# Altium schematic sheet Arduino Schematic.SchDoc
size A2; SheetNumber: 1; SheetTotal: 1
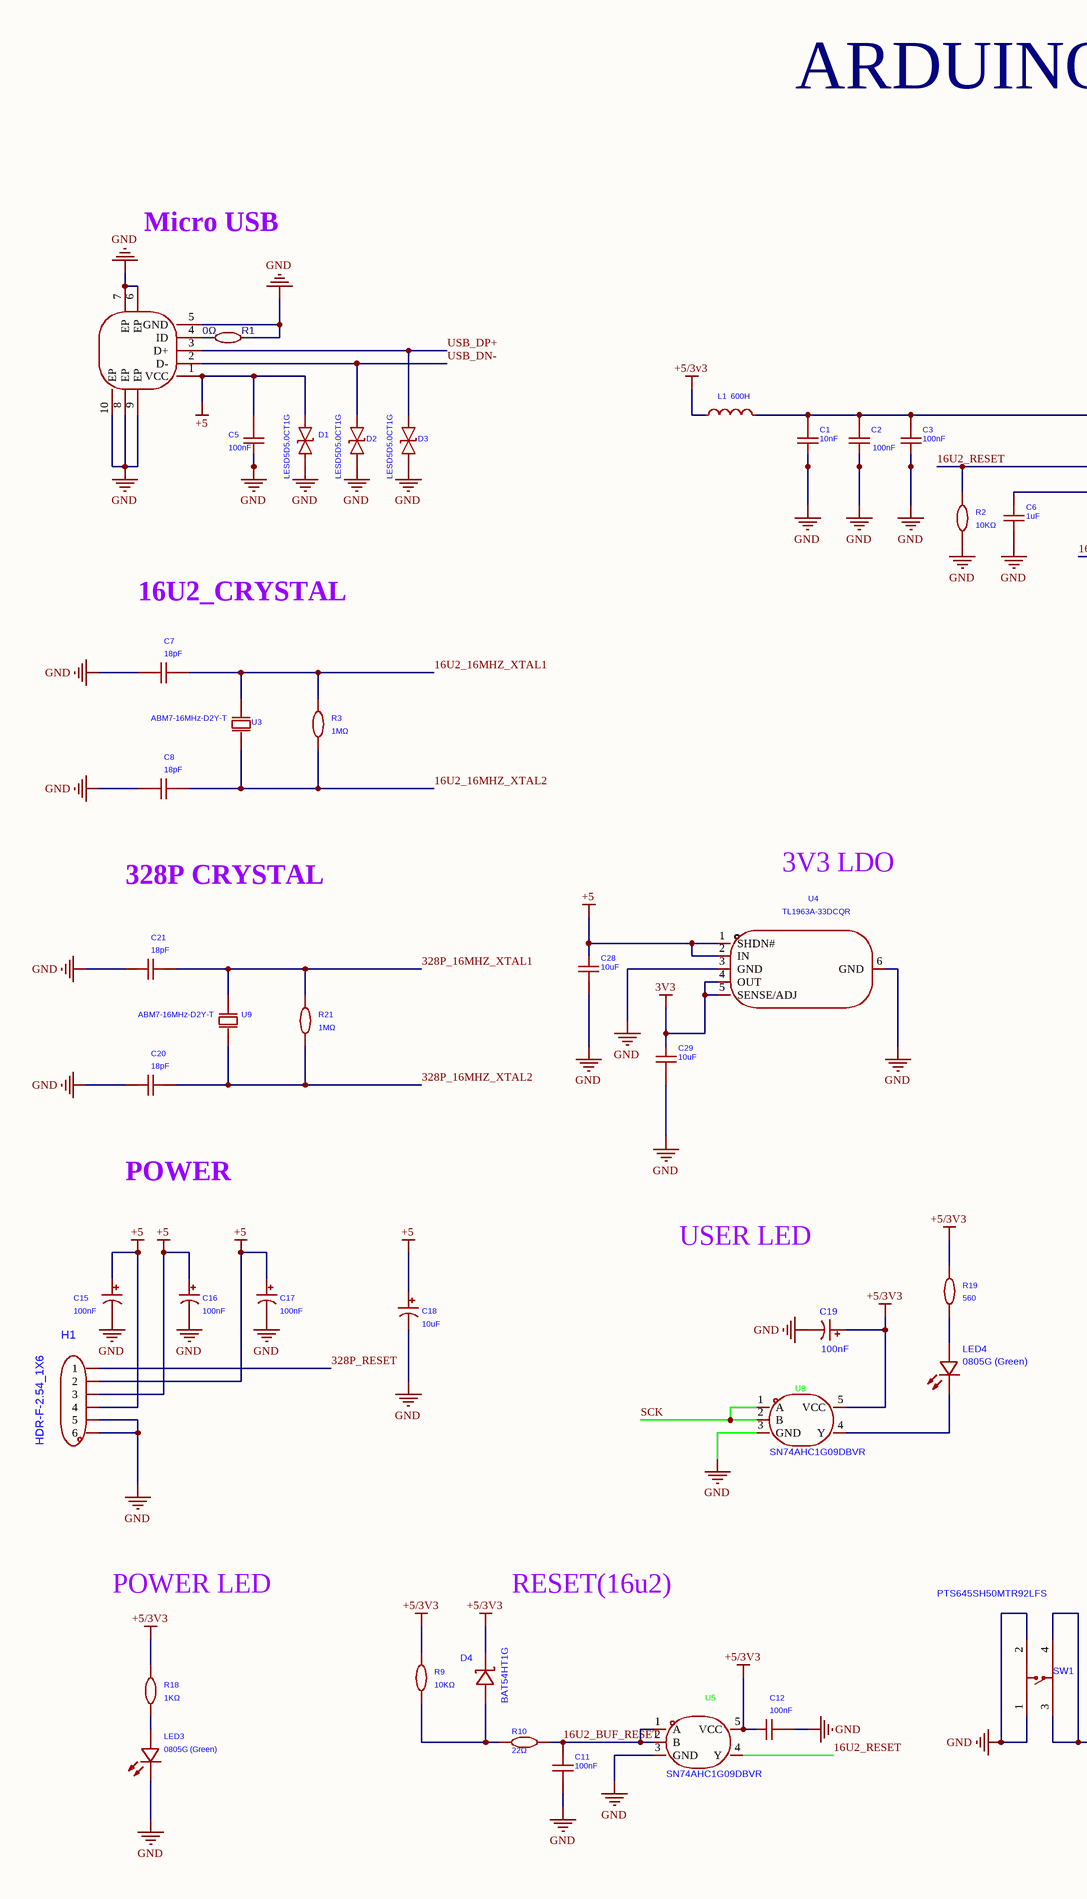
[diagram p0: Arduino Schematic.SchDoc, left]
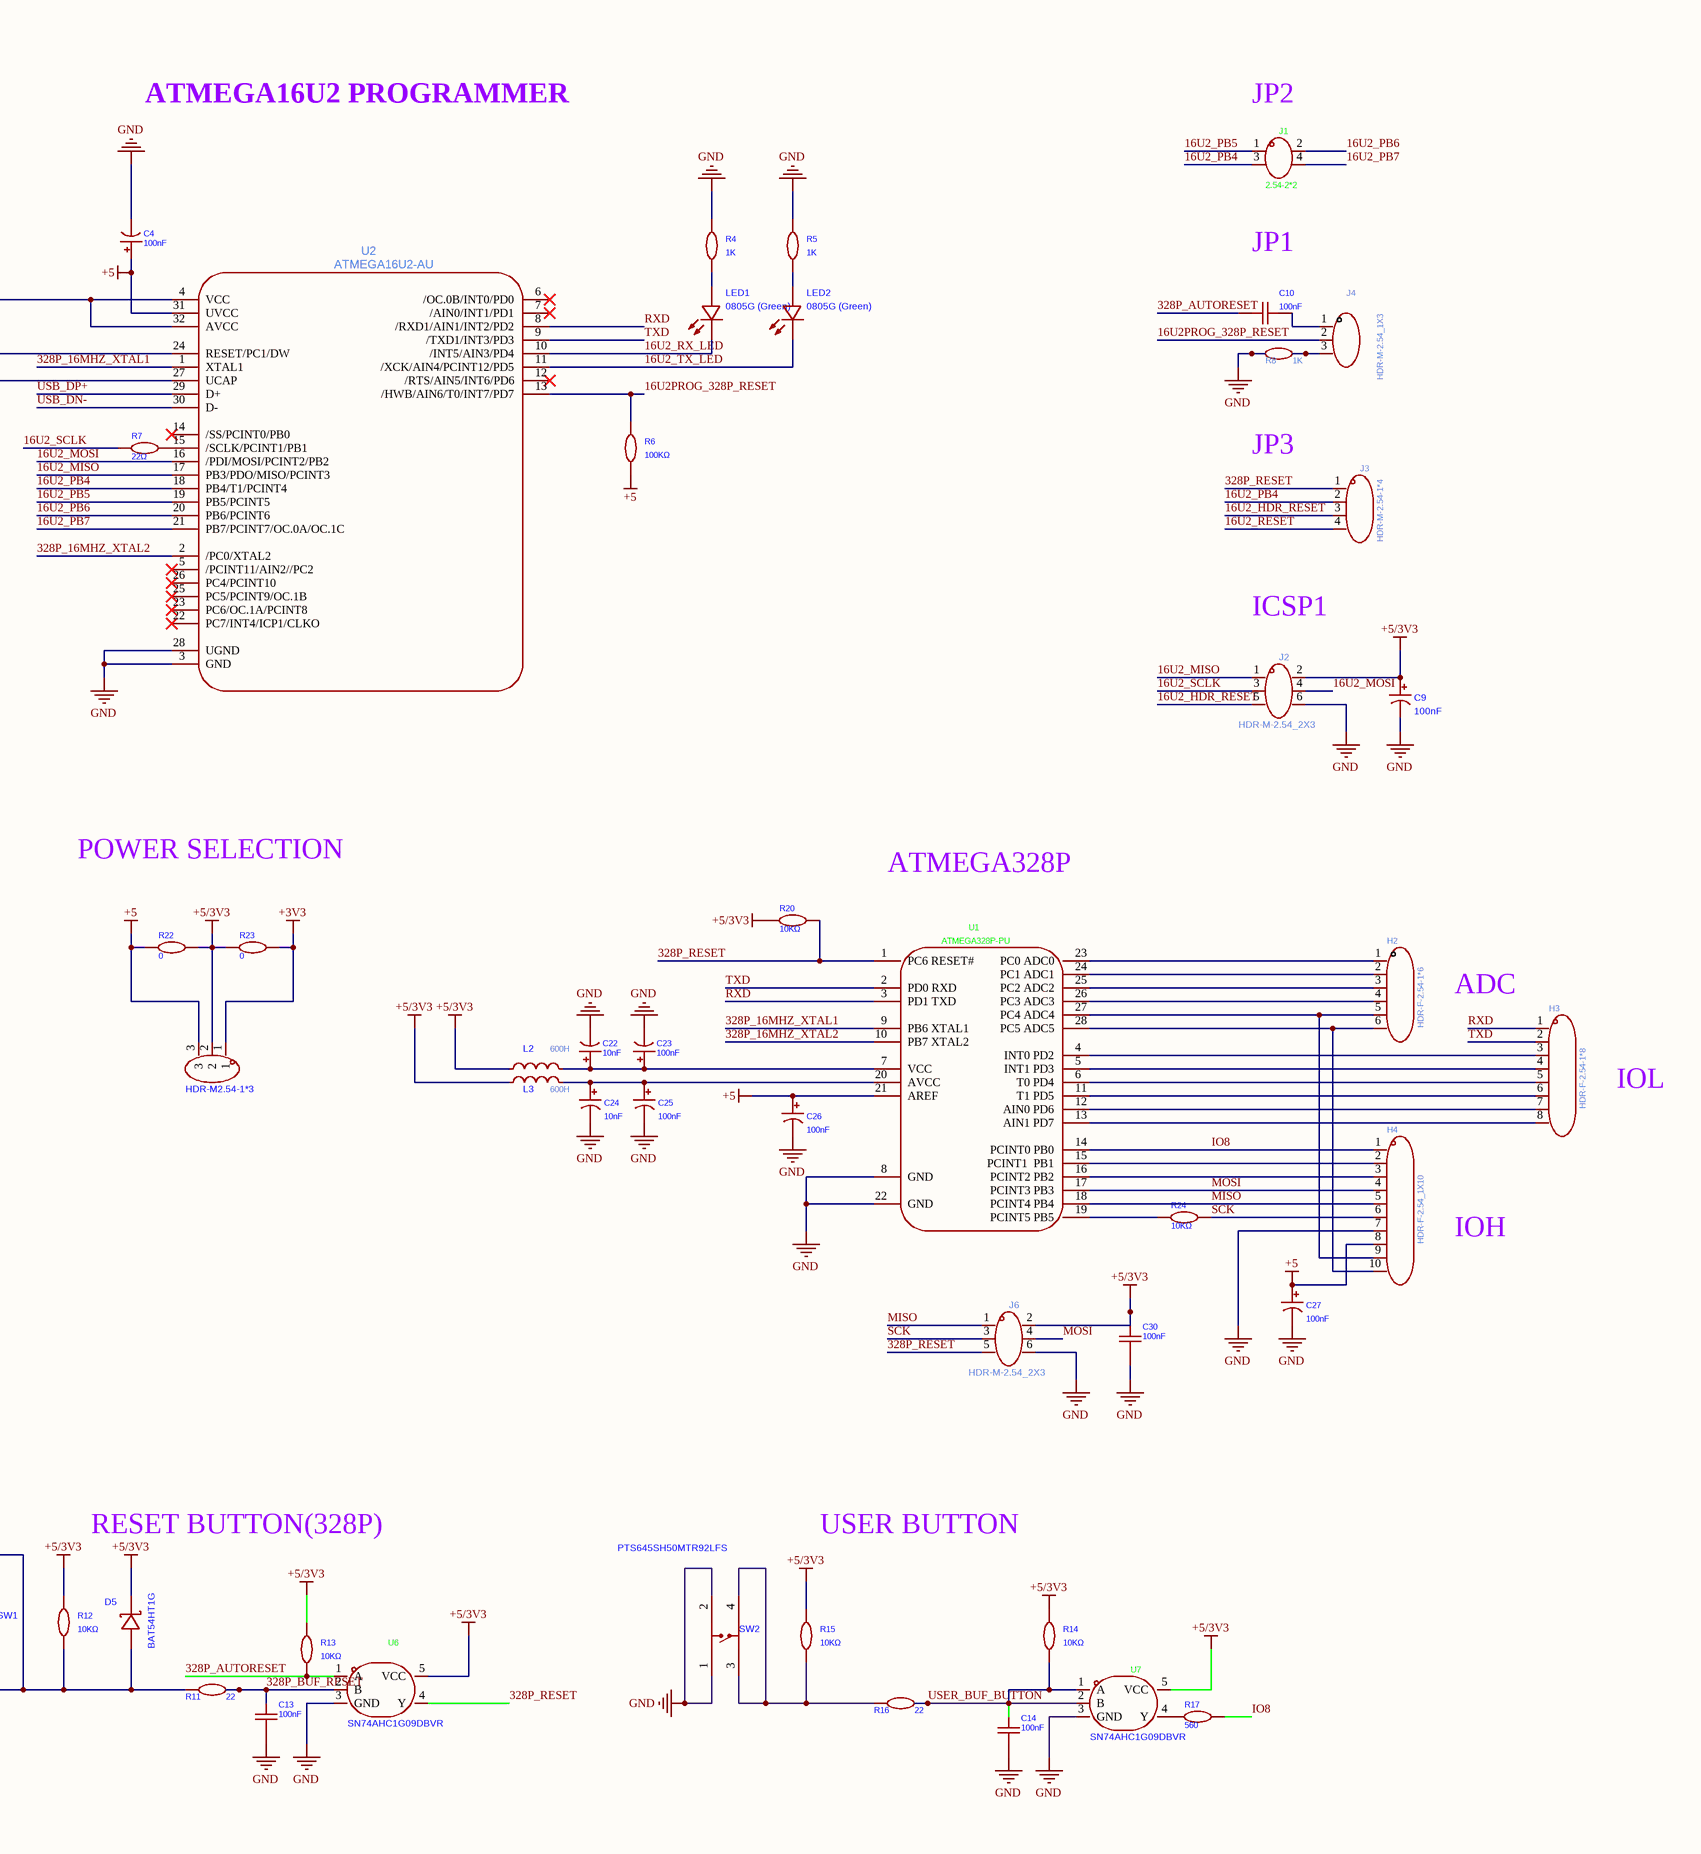
[diagram p1: Arduino Schematic.SchDoc, right]

## Parts
C1  10nF  [SOD-323_L1.8-W1.3-LS2.5-RD]
C2  100nF  [C0402]
C3  100nF  [C0402]
C4  100nF  [C0402]
C5  100nF  [C0402]
C6  1uF  [C0402]
C7  18pF  [C0402]
C8  18pF  [C0402]
C9  100nF  [C0402]
C10  100nF  [C0402]
C11  100nF  [C0402]
C12  100nF  [C0402]
C13  100nF  [C0402]
C14  100nF  [C0402]
C15  100nF  [C0402]
C16  100nF  [C0402]
C17  100nF  [C0402]
C18  10uF  [CAP-TH_BD5.0-P2.00-D0.8-FD]
C19  100nF  [C0402]
C20  18pF  [C0402]
C21  18pF  [C0402]
C22  10nF  [C0402]
C23  100nF  [C0402]
C24  10nF  [C0402]
C25  100nF  [C0402]
C26  100nF  [C0402]
C27  100nF  [C0402]
C28  10uF  [CAP-TH_BD5.0-P2.00-D0.8-FD]
C29  10uF  [C0402]
C30  100nF  [C0402]
D1  LESD5D5.0CT1G  [SOD-523_L1.2-W0.8-LS1.6-BI]
D2  LESD5D5.0CT1G  [SOD-523_L1.2-W0.8-LS1.6-BI]
D3  LESD5D5.0CT1G  [SOD-523_L1.2-W0.8-LS1.6-BI]
D4  BAT54HT1G  [SOD-323_L1.8-W1.3-LS2.5-RD]
D5  BAT54HT1G  [SOD-323_L1.8-W1.3-LS2.5-RD]
H1  HDR-F-2.54_1X6  [HDR-TH_6P-P2.54-V-M]
H2  HDR-F-2.54-1*6  [HDR-TH_6P-P2.54-V-M]
H3  HDR-F-2.54-1*8  [HDR-TH_8P-P2.54-V-F]
H4  HDR-F-2.54_1X10  [HDR-TH_10P-P2.54-V-F]
J1  2.54-2*2  [HDR-TH_4P-P2.54-V-F-R2-C2-S2.54]
J2  HDR-M-2.54_2X3  [HDR-TH_6P-P2.54-V-F-R2-C3-S2.54]
J3  HDR-M-2.54-1*4  [HDR-TH_4P-P2.54-V-F]
J4  HDR-M-2.54_1X3  [HDR-TH_3P-P2.54-V-F]
J5  HDR-M2.54-1*3  [HDR-TH_3P-P2.54-V-F]
J6  HDR-M-2.54_2X3  [HDR-TH_6P-P2.54-V-F-R2-C3-S2.54]
L1  600H  [L0402]
L2  600H  [L0402]
L3  600H  [L0402]
LED1  0805G (Green)  [LED0805-R-RD]
LED2  0805G (Green)  [LED0805-R-RD]
LED3  0805G (Green)  [LED0805-R-RD]
LED4  0805G (Green)  [LED0805-R-RD]
R1  0Ω  [R0603]
R2  10KΩ  [R0402]
R3  1MΩ  [R0402]
R4  1K  [R0402]
R5  1K  [R0402]
R6  100KΩ  [R0402]
R7  22Ω  [R0402]
R8  1K  [R0402]
R9  10KΩ  [R0402]
R10  22Ω  [R0402]
R11  22  [R0402]
R12  10KΩ  [R0402]
R13  10KΩ  [R0402]
R14  10KΩ  [R0402]
R15  10KΩ  [R0402]
R16  22  [R0402]
R17  560  [R0402]
R18  1KΩ  [R0402]
R19  560  [R0402]
R20  10KΩ  [R0402]
R21  1MΩ  [R0402]
R22  0  [R0402]
R23  0  [R0402]
R24  10KΩ  [R0402]
SW1  PTS645SH50MTR92LFS  [SW-TH_4P-L6.0-W6.0-P4.50-LS6.5]
SW2  PTS645SH50MTR92LFS  [SW-TH_4P-L6.0-W6.0-P4.50-LS6.5]
U1  ATMEGA328P-PU  [DIP-28_L34.6-W7.3-P2.54-LS10.2-BL]
U2  ATMEGA16U2-AU  [TQFP-32_L7.0-W7.0-P0.80-LS9.0-TL]
U3  ABM7-16MHz-D2Y-T  [OSC-SMD_L5.0-W3.2]
U4  TL1963A-33DCQR  [SOT-223-6_L6.5-W3.5-P1.27-LS7.0-BR]
U5  SN74AHC1G09DBVR  [SOT-23-5_L2.9-W1.6-P0.95-LS2.8-BL]
U6  SN74AHC1G09DBVR  [SOT-23-5_L2.9-W1.6-P0.95-LS2.8-BL]
U7  SN74AHC1G09DBVR  [SOT-23-5_L2.9-W1.6-P0.95-LS2.8-BL]
U8  SN74AHC1G09DBVR  [SOT-23-5_L2.9-W1.6-P0.95-LS2.8-BL]
U9  ABM7-16MHz-D2Y-T  [OSC-SMD_L5.0-W3.2]
USB1  1050170001  [MICRO-USB-SMD_105017-0001]  (value not drawn)

## Nets
3V3: C29.2 U4.4(OUT) U4.5(SENSE/ADJ)
+3V3: J5.1 R23.1
+5: C4.1 C5.2 C15.1 C16.1 C17.1 C18.1 C26.1 C27.1 C28.2 D1.2 H1.3(4) H1.4(3) H1.5(2) H4.8 J5.3 R6.1 R22.2 U1.21(AREF) U2.31(UVCC) U4.1(SHDN#) U4.2(IN) USB1.1(VCC)
+5/3V3: C9.1 C12.2 C19.1 C30.2 D4.1(K) D5.1(K) J2.2 J5.2 J6.2 L1.1 L2.1 L3.1 R9.2 R12.2 R13.2 R14.2 R15.2 R18.2 R19.2 R20.2 R22.1 R23.2 U5.5(VCC) U6.5(VCC) U7.5(VCC) U8.5(VCC)
GND: C1.1 C2.1 C3.1 C4.2 C5.1 C6.1 C7.1 C8.1 C9.2 C11.1 C12.1 C13.1 C14.1 C15.2 C16.2 C17.2 C18.2 C19.2 C20.1 C21.1 C22.2 C23.2 C24.2 C25.2 C26.2 C27.2 C28.1 C29.1 C30.1 D1.1 D2.1 D3.1 H1.1(6) H1.2(5) H4.7 J2.6 J6.6 LED3.2(K) R1.2 R2.1 R4.2 R5.2 R8.2 SW1.1 SW1.2 SW2.1 SW2.2 U1.8(GND) U1.22(GND) U2.3(GND) U2.28(UGND) U4.3(GND) U4.6(GND) U5.3(GND) U6.3(GND) U7.3(GND) U8.3(GND) USB1.5(GND) USB1.6(EP) USB1.7(EP) USB1.8(EP) USB1.9(EP) USB1.10(EP)
16U2_16MHZ_XTAL1: C7.2 R3.2 U3.2(OSC2)
16U2_16MHZ_XTAL2: C8.2 R3.1 U3.1(OSC1)
16U2_BUF_RESET: C11.2 R10.1 U5.1(A) U5.2(B)
16U2_HDR_RESET: J2.5 J3.3
16U2_MISO: J2.1 U2.17(PB3/PDO/MISO/PCINT3)
16U2_MOSI: J2.4 U2.16(/PDI/MOSI/PCINT2/PB2)
16U2_PB4: J1.3 J3.2 U2.18(PB4/T1/PCINT4)
16U2_PB5: J1.1 U2.19(PB5/PCINT5)
16U2_PB6: J1.2 U2.20(PB6/PCINT6)
16U2_PB7: J1.4 U2.21(PB7/PCINT7/OC.0A/OC.1C)
16U2_RESET: J3.4 R2.2 U2.24(RESET/PC1/DW) U5.4(Y)
16U2_RX_LED: LED1.2(K) U2.10(/INT5/AIN3/PD4)
16U2_SCLK: J2.3 R7.2
16U2_TX_LED: LED2.2(K) U2.11(/XCK/AIN4/PCINT12/PD5)
16U2PROG_328P_RESET: J4.2 R6.2 U2.13(/HWB/AIN6/T0/INT7/PD7)
328P_16MHZ_XTAL1: C21.2 R21.2 U1.9(PB6_XTAL1) U2.1(XTAL1) U9.2(OSC2)
328P_16MHZ_XTAL2: C20.2 R21.1 U1.10(PB7_XTAL2) U2.2(/PC0/XTAL2) U9.1(OSC1)
328P_AUTORESET: C10.2 R13.1 U6.1(A)
328P_BUF_RESET: C13.2 R11.1 U6.2(B)
328P_RESET: H1.6(1) J3.1 J6.5 R20.1 U1.1(PC6_RESET#) U6.4(Y)
IO8: H4.1 R17.1 U1.14(PCINT0_PB0)
MISO: H4.5 J6.1 U1.18(PCINT4_PB4)
MOSI: H4.4 J6.4 U1.17(PCINT3_PB3)
RXD: H3.1 U1.3(PD1_TXD) U2.8(/RXD1/AIN1/INT2/PD2)
SCK: H4.6 J6.3 R24.1 U8.1(A) U8.2(B)
TXD: H3.2 U1.2(PD0_RXD) U2.9(/TXD1/INT3/PD3)
USB_DN-: D2.2 U2.30(D-) USB1.2(D-)
USB_DP+: D3.2 U2.29(D+) USB1.3(D+)
USER_BUF_BUTTON: C14.2 R14.1 R16.1 U7.1(A) U7.2(B)
NetC1_2: C1.2 C2.2 C3.2 L1.2 U2.4(VCC) U2.32(AVCC)
NetC6_2: C6.2 U2.27(UCAP)
NetC10_1: C10.1 J4.1
NetC22_1: C22.1 C23.1 L2.2 U1.7(VCC)
NetC24_1: C24.1 C25.1 L3.2 U1.20(AVCC)
NetD4_2: D4.2(A) R9.1 R10.2
NetD5_2: D5.2(A) R11.2 R12.1 SW1.3 SW1.4
NetH2_1: H2.1 U1.23(PC0_ADC0)
NetH2_2: H2.2 U1.24(PC1_ADC1)
NetH2_3: H2.3 U1.25(PC2_ADC2)
NetH2_4: H2.4 U1.26(PC3_ADC3)
NetH2_5: H2.5 H4.9 U1.27(PC4_ADC4)
NetH2_6: H2.6 H4.10 U1.28(PC5_ADC5)
NetH3_3: H3.3 U1.4(INT0_PD2)
NetH3_4: H3.4 U1.5(INT1_PD3)
NetH3_5: H3.5 U1.6(T0_PD4)
NetH3_6: H3.6 U1.11(T1_PD5)
NetH3_7: H3.7 U1.12(AIN0_PD6)
NetH3_8: H3.8 U1.13(AIN1_PD7)
NetH4_2: H4.2 U1.15(PCINT1__PB1)
NetH4_3: H4.3 U1.16(PCINT2_PB2)
NetJ4_3: J4.3 R8.1
NetLED1_1: LED1.1(A) R4.1
NetLED2_1: LED2.1(A) R5.1
NetLED3_1: LED3.1(A) R18.1
NetLED4_1: LED4.1(A) R19.1
NetLED4_2: LED4.2(K) U8.4(Y)
NetR1_1: R1.1 USB1.4(ID)
NetR7_1: R7.1 U2.15(/SCLK/PCINT1/PB1)
NetR15_1: R15.1 R16.2 SW2.3 SW2.4
NetR17_2: R17.2 U7.4(Y)
NetR24_2: R24.2 U1.19(PCINT5_PB5)

Not connected (* = marked no-connect by the designer): U2 5(/PCINT11/AIN2//PC2)* 6(/OC.0B/INT0/PD0)* 7(/AIN0/INT1/PD1)* 12(/RTS/AIN5/INT6/PD6)* 14(/SS/PCINT0/PB0)* 22(PC7/INT4/ICP1/CLKO)* 23(PC6/OC.1A/PCINT8)* 25(PC5/PCINT9/OC.1B)* 26(PC4/PCINT10)*

## Notes on the sheet
- ARDUINO UNO BOARD DESIGN
- Micro USB
- ATMEGA16U2 PROGRAMMER
- (near J1) JP2
- JP1
- JP3
- 16U2_CRYSTAL
- ICSP1
- 328P CRYSTAL
- 3V3 LDO
- POWER SELECTION
- ATMEGA328P
- ADC
- POWER
- IOL
- USER LED
- IOH
- POWER LED
- RESET(16u2)
- RESET BUTTON(328P)
- USER BUTTON

## Library data of the parts
C1-C3 C5 C6 C10-C14 C28-C30 = GRM1555C1H180JA01D: Manufacturer: muRata(村田); Add into BOM: yes; Value: 18pF; Tolerance: ±5%; Symbol: GRM1555C1H180JA01D; Device: GRM1555C1H180JA01D; LCSC Part Name: 18pF ±5% 50V; Supplier Part: C33149; Manufacturer Part: GRM1555C1H180JA01D; Supplier Footprint: 0402; JLCPCB Part Class: Extended Part; Datasheet: https://atta.szlcsc.com/upload/public/pdf/source/20161108/1478586362936.pdf; Supplier: LCSC; Convert to PCB: yes
C4 C9 C15-C17 C19 C23 C25-C27 = KM104M050D11RR0VH2FP0: Manufacturer: CX(承兴); Symbol: 0.1UF 50V; Add into BOM: yes; Tolerance: ±20%; Lifetime @ Temp: 1000hrs@105℃; Device: KM104M050D11RR0VH2FP0; LCSC Part Name: 100nF ±20% 50V; Supplier Part: C28061; Manufacturer Part: KM104M050D11RR0VH2FP0; Supplier Footprint: 插件,D5xL11mm; JLCPCB Part Class: Extended Part; Datasheet: https://atta.szlcsc.com/upload/public/pdf/source/20211027/06D6BA3719C264B639DC286D935D03EA.pdf; Supplier: LCSC; Convert to PCB: yes; Value: 100nF
C7 C8 C20 C21 = GRM1555C1H180JA01D: Manufacturer: muRata(村田); Add into BOM: yes; Tolerance: ±5%; Symbol: GRM1555C1H180JA01D; Device: GRM1555C1H180JA01D; LCSC Part Name: 18pF ±5% 50V; Supplier Part: C33149; Manufacturer Part: GRM1555C1H180JA01D; Supplier Footprint: 0402; JLCPCB Part Class: Extended Part; Datasheet: https://atta.szlcsc.com/upload/public/pdf/source/20161108/1478586362936.pdf; Supplier: LCSC; Convert to PCB: yes; Value: 18pF
C18 C22 C24 = KM104M050D11RR0VH2FP0: Manufacturer: CX(承兴); Symbol: 0.1UF 50V; Add into BOM: yes; Value: 100nF; Tolerance: ±20%; Lifetime @ Temp: 1000hrs@105℃; Device: KM104M050D11RR0VH2FP0; LCSC Part Name: 100nF ±20% 50V; Supplier Part: C28061; Manufacturer Part: KM104M050D11RR0VH2FP0; Supplier Footprint: 插件,D5xL11mm; JLCPCB Part Class: Extended Part; Datasheet: https://atta.szlcsc.com/upload/public/pdf/source/20211027/06D6BA3719C264B639DC286D935D03EA.pdf; Supplier: LCSC; Convert to PCB: yes
D1-D3 = LESD5D5.0CT1G: Manufacturer: LRC(乐山无线电); Add into BOM: yes; polarity: Bidirectional; Reverse Stand-Off Voltage (Vrwm): 5V; Maximum Clamping Voltage: 18.6V; Peak Pulse Current (Ipp): 9.4A; Breakdown Voltage: 5.6V; Type: ESD; Symbol: LESD5D5.0CT1G; Device: LESD5D5.0CT1G; LCSC Part Name: 双向ESD; Supplier Part: C383211; Manufacturer Part: LESD5D5.0CT1G; Supplier Footprint: SOD-523; JLCPCB Part Class: Extended Part; Datasheet: https://atta.szlcsc.com/upload/public/pdf/source/20190807/C383211_633DF4B4E2C161403226E5235FE33A1C.pdf; Supplier: LCSC; Convert to PCB: yes
D4 D5 = BAT54HT1G: Manufacturer: onsemi(安森美); Add into BOM: yes; Forward Voltage (Vf@If): 800mV@100mA; Reverse Voltage (Vr): 30V; Rectified Current: 200mA; Reverse Leakage Current (Ir): 2uA@25V; Symbol: BAT54HT1G; Device: BAT54HT1G; LCSC Part Name: 电压:30V 电流:200mA; Supplier Part: C21107; Manufacturer Part: BAT54HT1G; Supplier Footprint: SOD-323; JLCPCB Part Class: Extended Part; Datasheet: https://atta.szlcsc.com/upload/public/pdf/source/20131023/1457706657764.pdf; Supplier: LCSC; Convert to PCB: yes
H1 = HB-PH3-25416PB2GOP: Manufacturer: HANBO(汉博); Add into BOM: yes; Pin Structure: 1x6P; Pitch: 2.54mm; Circluar Pins/Square Pins: Policy; Current Rating: 3A; Voltage Rating (Max): 250V; Symbol: HB-PH3-25416PB2GOP; Device: HB-PH3-25416PB2GOP; LCSC Part Name: 1x6P 间距:2.54mm 方针 直插; Supplier Part: C6332199; Manufacturer Part: HB-PH3-25416PB2GOP; Supplier Footprint: 插件,P=2.54mm; JLCPCB Part Class: Extended Part; Datasheet: https://atta.szlcsc.com/upload/public/pdf/source/20230803/F72D259687963761DF1B552F3BB84A31.pdf; Supplier: LCSC; Convert to PCB: yes; Row Spacing: 2.54mm; Mounting Type: Straight; Number of Rows: Single Row; Number of Pins: 6P; Length of Mating Pin: 6mm; Insulation Height: 2.54mm; Length of End Connection Pin: 3mm; Contact Material: Brass; Contact Plating: Gold; Operating Temperature: -40℃~+105℃; Color: Black
H2 = 2.54-1*6: Manufacturer: ZHOURI(洲日); Add into BOM: yes; Pin Structure: 1x6P; Pitch: 2.54mm; Symbol: 2.54-1*6; Device: 2.54-1*6; LCSC Part Name: 2.54-1*6; Supplier Part: C5156615; Manufacturer Part: 2.54-1*6; Supplier Footprint: 插件,P=2.54mm; JLCPCB Part Class: Extended Part; Datasheet: https://atta.szlcsc.com/upload/public/pdf/source/20250227/F941FC765EF241ABFB2D5D72948A31A5.pdf; Supplier: LCSC; Convert to PCB: yes; Number of Rows: Single Row; Number of Pins: 6P
H3 = PM2.54-1*8: Manufacturer: ZHOURI(洲日); Add into BOM: yes; Holes Structure: 1x8P; Pitch: 2.54mm; Circular Hole / Square Hole: 方孔; Number of Holes: 8P; Current Rating (Max): 2.5A; Holes Direction: Top; Symbol: PM2.54-1*8; Device: PM2.54-1*8; LCSC Part Name: 间距:2.54mm 1x8P 直插; Supplier Part: C5224027; Manufacturer Part: PM2.54-1*8; Supplier Footprint: 插件,P=2.54mm; JLCPCB Part Class: Extended Part; Datasheet: https://atta.szlcsc.com/upload/public/pdf/source/20221031/E5BAE727A502DC7C69CE947E807E2296.pdf; Supplier: LCSC; Convert to PCB: yes; Row Spacing: 2.54mm; Mounting Type: Straight; Number of Rows: Plugin; Insulation Height: 8.5mm; Operating Temperature Range: -40℃~+105℃
H4 = BX-PM2.54-1-10PY: Manufacturer: Bossie(博锡); Add into BOM: yes; Holes Structure: 1x10P; Pitch: 2.54mm; Circular Hole / Square Hole: Square Hole; Number of Holes: 10P; Voltage Rating (Max): 1kV; Holes Direction: Top; Soldering Temperature(Max): 260℃@5S; Symbol: BX-PM2.54-1-10PY; Device: BX-PM2.54-1-10PY; LCSC Part Name: 1x10P 间距:2.54mm 直插; Supplier Part: C18078132; Manufacturer Part: BX-PM2.54-1-10PY; Supplier Footprint: 插件,P=2.54mm; JLCPCB Part Class: Extended Part; Datasheet: https://atta.szlcsc.com/upload/public/pdf/source/20231017/732584F7F0B2D917FE86A7328410C345.pdf; Supplier: LCSC; Convert to PCB: yes; Row Spacing: -; Mounting Type: Direct Insert; Number of Rows: Single Row; Current Rating (Max): -; Insulation Height: 8.5mm; Contact Material: -; Contact Plating: Gold; Operating Temperature Range: -40℃~+105℃
J1 = 2.54-2*2: Manufacturer: ZHOURI(洲日); Add into BOM: yes; Holes Structure: 2x2P; Pitch: 2.54mm; Circular Hole / Square Hole: Square Holes; Number of Holes: 4P; Current Rating (Max): 2.5A; Holes Direction: Top; Symbol: 2.54-2*2; Device: 2.54-2*2; LCSC Part Name: 间距:2.54mm 2x2P 直插; Supplier Part: C2977590; Manufacturer Part: 2.54-2*2; Supplier Footprint: 插件,P=2.54mm; JLCPCB Part Class: Extended Part; Datasheet: https://atta.szlcsc.com/upload/public/pdf/source/20220328/0DEB63D734370D90CA736158671615A0.pdf; Supplier: LCSC; Convert to PCB: yes; Row Spacing: 2.54mm; Mounting Type: Straight; Number of Rows: 双排; Voltage Rating (Max): -; Insulation Height: 8.5mm; Operating Temperature Range: -40℃~+105℃
J2 J6 = PM254-2-03-Z-8.5: Manufacturer: HCTL(华灿天禄); Add into BOM: yes; Holes Structure: 2x3P; Pitch: 2.54mm; Circular Hole / Square Hole: Square Holes; Number of Holes: 6P; Current Rating (Max): 3A; Holes Direction: Top; Soldering Temperature(Max): 260℃@5S; Symbol: PM254-2-03-Z-8.5; Device: PM254-2-03-Z-8.5; LCSC Part Name: 2x3P 间距:2.54mm 直插; Supplier Part: C2897404; Manufacturer Part: PM254-2-03-Z-8.5; Supplier Footprint: 插件,P=2.54mm; JLCPCB Part Class: Extended Part; Datasheet: https://atta.szlcsc.com/upload/public/pdf/source/20230609/3D36CA2C1BFC9FD1C3F709AD9DFEB9C2.pdf; Supplier: LCSC; Convert to PCB: yes; Row Spacing: 2.54mm; Mounting Type: Straight; Number of Rows: 双排; Voltage Rating (Max): -; Insulation Height: 8.5mm; Contact Material: Copper Alloy; Operating Temperature Range: -40℃~+105℃
J3 = PM2.54-1*4: Manufacturer: ZHOURI(洲日); Add into BOM: yes; Holes Structure: 1x4P; Pitch: 2.54mm; Circular Hole / Square Hole: 方孔; Number of Holes: 4P; Current Rating (Max): 2.5A; Holes Direction: Top; Symbol: PM2.54-1*4; Device: PM2.54-1*4; LCSC Part Name: 间距:2.54mm 1x4P 直插; Supplier Part: C5116530; Manufacturer Part: PM2.54-1*4; Supplier Footprint: 插件,P=2.54mm; JLCPCB Part Class: Extended Part; Datasheet: https://atta.szlcsc.com/upload/public/pdf/source/20220729/3385E3C3A9122AF204A83235A2975C64.pdf; Supplier: LCSC; Convert to PCB: yes; Row Spacing: 2.54mm; Mounting Type: Straight; Number of Rows: Plugin; Insulation Height: 8.5mm; Operating Temperature Range: -40℃~+105℃
J4 = PM254V-11-03-H85: Manufacturer: XFCN(兴飞); Add into BOM: yes; Holes Structure: 1x3P; Pitch: 2.54mm; Number of Holes: 3P; Symbol: PM254V-11-03-H85; Device: PM254V-11-03-H85; LCSC Part Name: 间距:2.54mm 1x3P 直插; Supplier Part: C541850; Manufacturer Part: PM254V-11-03-H85; Supplier Footprint: 插件,P=2.54mm; JLCPCB Part Class: Extended Part; Datasheet: https://atta.szlcsc.com/upload/public/pdf/source/20200518/C541849_85853D71FC67C51915A806977A588FDA.pdf; Supplier: LCSC; Convert to PCB: yes; Row Spacing: -; Mounting Type: Straight; Number of Rows: Plugin; Insulation Height: -; Contact Material: Brass; Contact Plating: -
J5 = PM2.54-1*3: Manufacturer: ZHOURI(洲日); Add into BOM: yes; Holes Structure: 1x3P; Pitch: 2.54mm; Circular Hole / Square Hole: 方孔; Number of Holes: 3P; Current Rating (Max): 2.5A; Holes Direction: Top; Symbol: PM2.54-1*3; Device: PM2.54-1*3; LCSC Part Name: 间距:2.54mm 1x3P 直插; Supplier Part: C5116529; Manufacturer Part: PM2.54-1*3; Supplier Footprint: 插件,P=2.54mm; JLCPCB Part Class: Extended Part; Datasheet: https://atta.szlcsc.com/upload/public/pdf/source/20220729/0B9CDCB2053AD78CED9CDFEF888323E9.pdf; Supplier: LCSC; Convert to PCB: yes; Row Spacing: 2.54mm; Mounting Type: Straight; Number of Rows: Plugin; Insulation Height: 8.5mm; Operating Temperature Range: -40℃~+105℃
L1-L3 = LQG15HS9N1J02D: Manufacturer: muRata(村田); Add into BOM: yes; Value: 9.1nH; Tolerance: ±5%; Q @ Freq: 8@100MHz; Type: 叠层电感; Symbol: LQG15HS9N1J02D; Device: LQG15HS9N1J02D; LCSC Part Name: 9.1nH ±5%; Supplier Part: C162547; Manufacturer Part: LQG15HS9N1J02D; Supplier Footprint: 0402; JLCPCB Part Class: Extended Part; Datasheet: https://atta.szlcsc.com/upload/public/pdf/source/20180612/C185484_14F678484DDF036353DC67B6265A9221.pdf; Supplier: LCSC; Convert to PCB: yes; Saturation Current (Isat): -
LED1-LED4 = KT-0805G: Manufacturer: KENTO; Add into BOM: yes; Emitted Color: Emerald; Symbol: 0805G (Green); Device: KT-0805G; LCSC Part Name: 0805 翠绿 高亮; Supplier Part: C2297; Manufacturer Part: KT-0805G; Supplier Footprint: 0805; JLCPCB Part Class: Basic Part; Datasheet: https://atta.szlcsc.com/upload/public/pdf/source/20170209/1486607340485.pdf; Supplier: LCSC; Convert to PCB: yes; Lamp Holder Type: -; Forward Voltage (VF): -; Power Dissipation: -; Forward Current: -; Dominant Wavelength: -; Peak Wavelength: -; Diode Configuration: -; Lens Color: -; Color Temperature: -; Luminous Intensity: -; Viewing Angle: -; Mounting Sytle: -; Operating Temperature: -
R1 = 0Ω: Manufacturer: YAGEO(国巨); Manufacturer Part: RC0603FR-070RL; nameAlias: Value; Supplier: LCSC; Supplier Part: C100044; JLCPCB Part Class: Extended Part; spicePre: R; spiceSymbolName: RC0603FR-070RL
R2 R4-R20 R22-R24 = WSL25121L000FEA18: Manufacturer: VISHAY(威世); Add into BOM: yes; Value: 1mΩ; Tolerance: ±1%; Temperature Coefficient: ±275ppm/℃; Mounting Sytle: Surface Mount; Symbol: WSL25121L000FEA18; Device: WSL25121L000FEA18; LCSC Part Name: 1mΩ ±1% 2W; Supplier Part: C149567; Manufacturer Part: WSL25121L000FEA18; Supplier Footprint: 2512; JLCPCB Part Class: Extended Part; Datasheet: https://atta.szlcsc.com/upload/public/pdf/source/20180730/C149567_AEEE3780A8EE98747C02CEA4CDC81D3F.pdf; Supplier: LCSC; Convert to PCB: yes; Type: Current Sensing Resistors; Rated Output Voltage: -; Rated Current: -
R3 R21 = WSL25121L000FEA18: Manufacturer: VISHAY(威世); Add into BOM: yes; Tolerance: ±1%; Temperature Coefficient: ±275ppm/℃; Mounting Sytle: Surface Mount; Symbol: WSL25121L000FEA18; Device: WSL25121L000FEA18; LCSC Part Name: 1mΩ ±1% 2W; Supplier Part: C149567; Manufacturer Part: WSL25121L000FEA18; Supplier Footprint: 2512; JLCPCB Part Class: Extended Part; Datasheet: https://atta.szlcsc.com/upload/public/pdf/source/20180730/C149567_AEEE3780A8EE98747C02CEA4CDC81D3F.pdf; Supplier: LCSC; Convert to PCB: yes; Type: Current Sensing Resistors; Value: 1mΩ; Rated Output Voltage: -; Rated Current: -
SW1 SW2 = TC-00104FB-110E-03: Manufacturer: HOOYA(皓宇电子); Add into BOM: yes; Contact Current: 50mA; Voltage Rating (DC): 12V; Symbol: TC-00104FB-110E-03; Device: TC-00104FB-110E-03; LCSC Part Name: TC-00104FB-110E-03; Supplier Part: C7542981; Manufacturer Part: TC-00104FB-110E-03; Supplier Footprint: DIP; JLCPCB Part Class: Extended Part; Datasheet: https://atta.szlcsc.com/upload/public/pdf/source/20240226/4796A29EA251D564C3D729191F5C4338.pdf; Supplier: LCSC; Convert to PCB: yes
U1 = ATMEGA328P-PU: Manufacturer: MICROCHIP(美国微芯); Add into BOM: yes; CPU Core: AVR; Program Storage Size: 32KB; RAM Size: 2KB; GPIO Ports Number: 23; Operating Voltage Range: 1.8V~5.5V; CPU Maximum Speed: 20MHz; Program Memory Type: FLASH; EEPROM: 1KB; ADC (Bit): 10bit; Peripheral/Function: WDT；PWM; Watchdog: 有; Symbol: ATMEGA328P-PU; Device: ATMEGA328P-PU; LCSC Part Name: 基于AVR增强型RISC架构的低功耗CMOS 8位微控制器 MSL=1; Supplier Part: C33901; Manufacturer Part: ATMEGA328P-PU; Supplier Footprint: DIP-28-300mil; JLCPCB Part Class: Extended Part; Datasheet: https://atta.szlcsc.com/upload/public/pdf/source/20150124/1457707257819.pdf; Supplier: LCSC; Convert to PCB: yes; Operating Temperature Range: -40℃~+85℃; DAC (Bit): -; PWM (Bit): -; Universal Serial Bus: -; Internal Comparator: -; communication protocol: -; Real-Time Clock: -; Infrared Data Association: -; Low-Voltage Detect: 有; CCP Capture/Compare: -; Secure Digital Input and Output: -; Direct Memory Access: -; Internal Oscillator: 有
U2 = ATMEGA16U2-AU: Manufacturer: MICROCHIP(美国微芯); Add into BOM: yes; CPU Core: AVR; Program Storage Size: 16KB; RAM Size: 512Byte; GPIO Ports Number: 22; Operating Voltage Range: 2.7V~5.5V; CPU Maximum Speed: 16MHz; Program Memory Type: FLASH; Universal Serial Bus: 有; Peripheral/Function: WDT；PWM; Symbol: ATMEGA16U2-AU; Device: ATMEGA16U2-AU; LCSC Part Name: ATMEGA16U2-AU; Supplier Part: C59019; Manufacturer Part: ATMEGA16U2-AU; Supplier Footprint: TQFP-32(7x7); JLCPCB Part Class: Extended Part; Datasheet: https://atta.szlcsc.com/upload/public/pdf/source/20150921/1457707392275.pdf; Supplier: LCSC; Convert to PCB: yes; EEPROM: 512Byte; Operating Temperature Range: -40℃~+85℃; ADC (Bit): -; DAC (Bit): -; PWM (Bit): -; Internal Comparator: -; communication protocol: -; Watchdog: 有; Real-Time Clock: -; Infrared Data Association: -; Low-Voltage Detect: 有; CCP Capture/Compare: -; Secure Digital Input and Output: -; Direct Memory Access: -; Internal Oscillator: 有
U3 U9 = X503216MSB2GI: Manufacturer: YXC(扬兴晶振); Add into BOM: yes; Value: 16MHz; Normal temperature Frequency Tolerance: ±10ppm; Frequency Stability: ±20ppm; Symbol: X503216MSB2GI; Device: X503216MSB2GI; LCSC Part Name: 16MHz ±10ppm 20pF; Supplier Part: C112572; Manufacturer Part: X503216MSB2GI; Supplier Footprint: SMD5032; JLCPCB Part Class: Extended Part; Datasheet: https://atta.szlcsc.com/upload/public/pdf/source/20240329/44922B0AF7B60E58E9B66993B6077277.pdf; Supplier: LCSC; Convert to PCB: yes; Type: Surface Mount Crystal; Operating Temperature: -40℃~+85℃
U4 = TL1963A-33DCQR: Manufacturer: TI(德州仪器); Add into BOM: yes; Output Type: Fixed; Maximum Input Voltage: 20V; Output Voltage: 3.3V; Output Current: 1.5A; Power Supply Rejection Ratio (PSRR): 63dB@(120Hz); Dropout Voltage: 550mV@(1.5A); standby current: 1mA; Output Polarity: Positive electrode; Number of Outputs: 1; Symbol: TL1963A-33DCQR; Device: TL1963A-33DCQR; LCSC Part Name: 具有反向电流和反向电压保护功能的 1.5A、20V 超低压降稳压器; Supplier Part: C2873060; Manufacturer Part: TL1963A-33DCQR; Supplier Footprint: SOT-223-6; JLCPCB Part Class: Extended Part; Datasheet: https://www.ti.com/cn/lit/gpn/tl1963a; Supplier: LCSC; Convert to PCB: yes; Feature: 防静电保护；低ESR；Thermal Protection(TSD)；Overcurrent Protection(OCP)；带使能; Operating Temperature: -40℃~+125℃
U5-U8 = SN74AHC1G09DBVR: Manufacturer: TI(德州仪器); Add into BOM: yes; Logic Gate Type: 与门; Number of Channels: 1; Supply Voltage: 2V~5.5V; Quiescent Current (Max): 1uA; Sink Current: 8mA; High Level Range (VIH): 1.5V~3.85V; Low Level Range (VIL): 500mV~1.65V; Propagation Delay Time: 7.5ns@5V,50pF; Symbol: SN74AHC1G09DBVR; Device: SN74AHC1G09DBVR; LCSC Part Name: SN74AHC1G09DBVR; Supplier Part: C840099; Manufacturer Part: SN74AHC1G09DBVR; Supplier Footprint: SOT-23-5; JLCPCB Part Class: Extended Part; Datasheet: https://www.ti.com/cn/lit/gpn/sn74ahc1g09; Supplier: LCSC; Convert to PCB: yes; Source Current: -; Series: 74AHCSeries; Operating Temperature: -55℃~+125℃
USB1 = 1050170001: Manufacturer: MOLEX; Symbol: 105017-0001; Add into BOM: yes; Connector Type: Micro-B; Gender: Female; Number of Ports: 1; Number of Contacts: 5P; Device: 1050170001; LCSC Part Name: Micro-B 母 卧贴; Supplier Part: C136000; Manufacturer Part: 1050170001; Supplier Footprint: SMD; JLCPCB Part Class: Extended Part; Datasheet: https://atta.szlcsc.com/upload/public/pdf/source/20171113/C136000_15105610884381115465.pdf; Supplier: LCSC; Convert to PCB: yes; Standard: USB 2.0; Mounting Style: 卧贴; Current Rating - Power (Max): -; Operating Temperature Range: -30℃~+85℃